# Altium project PHANTOM_VCU.PrjPcb
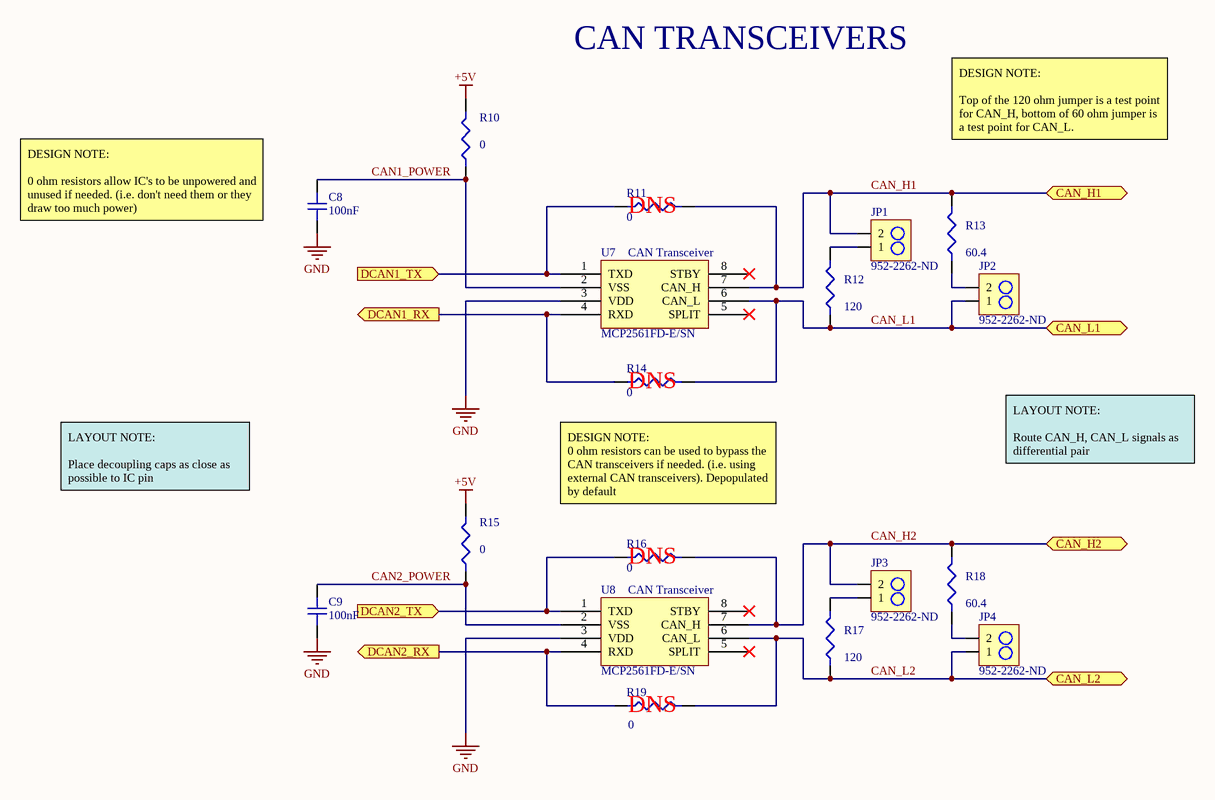
[diagram p0: CAN.SchDoc]
2 sheets, 43 parts. Net scope: flat (ports and power ports of the same name join across sheets).
Board file: VCU_LAYOUT.PcbDoc
Sheets:
  CAN.SchDoc
  Contactor_Switching.SchDoc

## Sheet CAN.SchDoc
size A4; DocumentNumber: 4; SheetNumber: 5; SheetTotal: 7

### Parts
C8  100nF  [C0805]
C9  100nF  [C0805]
JP1  952-2262-ND  [2PIN_HEADER]
JP2  952-2262-ND  [2PIN_HEADER]
JP3  952-2262-ND  [2PIN_HEADER]
JP4  952-2262-ND  [2PIN_HEADER]
R10  0  [R0805]
R11  0  [R0805]
R12  120  [R0805]
R13  60.4  [R0805]
R14  0  [R0805]
R15  0  [R0805]
R16  0  [R0805]
R17  120  [R0805]
R18  60.4  [R0805]
R19  0  [R0805]
U7  MCP2561FD-E/SN  [8-SOIC_MCP2561]
U8  MCP2561FD-E/SN  [8-SOIC_MCP2561]

### Ports
CAN_H1, CAN_H2, CAN_L1, CAN_L2, DCAN1_RX, DCAN1_TX, DCAN2_RX, DCAN2_TX

### Nets
+5V: R10.2 R15.2
GND: C8.1 C9.1 U7.3(VDD) U8.3(VDD)
CAN1_POWER: C8.2 R10.1 U7.2(VSS)
CAN2_POWER: C9.2 R15.1 U8.2(VSS)
CAN_H1: JP1.2 R11.2 R13.2 U7.7(CAN_H) ; port CAN_H1
CAN_H2: JP3.2 R16.2 R18.2 U8.7(CAN_H) ; port CAN_H2
CAN_L1: JP2.1 R12.1 R14.2 U7.6(CAN_L) ; port CAN_L1
CAN_L2: JP4.1 R17.1 R19.2 U8.6(CAN_L) ; port CAN_L2
NetJP1_1: JP1.1 R12.2
NetJP2_2: JP2.2 R13.1
NetJP3_1: JP3.1 R17.2
NetJP4_2: JP4.2 R18.1
NetR11_1: R11.1 U7.1(TXD) ; port DCAN1_TX
NetR14_1: R14.1 U7.4(RXD) ; port DCAN1_RX
NetR16_1: R16.1 U8.1(TXD) ; port DCAN2_TX
NetR19_1: R19.1 U8.4(RXD) ; port DCAN2_RX

Not connected (* = marked no-connect by the designer): U7 5(SPLIT)* 8(STBY)*; U8 5(SPLIT)* 8(STBY)*

### Notes on the sheet
- CAN TRANSCEIVERS
- DESIGN NOTE:
  Top of the 120 ohm jumper is a test point for CAN_H, bottom of 60 ohm jumper is a test point for CAN_L.
- DESIGN NOTE:
  0 ohm resistors allow IC's to be unpowered and unused if needed. (i.e. don't need them or they draw too much power)
- (near R11) DNS
- (near U7) CAN Transceiver
- (near R14) DNS
- LAYOUT NOTE:
  Place decoupling caps as close as possible to IC pin
- LAYOUT NOTE:
  Route CAN_H, CAN_L signals as differential pair
- DESIGN NOTE:
  0 ohm resistors can be used to bypass the CAN transceivers if needed. (i.e. using external CAN transceivers). Depopulated by default
- (near U8) CAN Transceiver
- (near R16) DNS
- (near R19) DNS

### Library data of the parts
C8 C9 = GRM21B7U1A104JA01L: MLCC SMD CAP 100nF 10Volts U2J 5%; Manufacturer: Murata; Voltage Rating: 10V; Supplier 1: Digi-Key; Manufacturer Part Number: GRM21B7U1A104JA01L; Stock 1: 6000; Pricing 1: 1=0.46, 10=0.32, 100=0.192, 500=0.144, 1000=0.1216 (USD); Mount: Surface Mount; Case/Package: 0805; Case Code (Imperial): 0805; Case Code (Metric): 2012; Min Operating Temperature: -55°C; Max Operating Temperature: 125°C; Capacitance: 100nF; Voltage Rating (DC): 10V; Tolerance: 5%; Packaging: Tape and Reel; Package Quantity: 3000; Dielectric: U2J; Termination: SMD/SMT; Length: 2mm; Height: 1.25mm; Width: 0.049inch; Thickness: 0.053inch; Depth: 1.25mm; Radiation Hardening: No; ComponentLink1URL: https://datasheet.ciiva.com/5424/product-5424660.pdf; ComponentLink1Description: https://datasheet.ciiva.com/5424/product-5424660.pdf; ComponentLink2URL: https://datasheet.ciiva.com/17451/product-17451845.pdf; ComponentLink2Description: https://datasheet.ciiva.com/17451/product-17451845.pdf; ComponentLink3URL: https://datasheet.ciiva.com/11618/product-11618924.pdf; ComponentLink3Description: https://datasheet.ciiva.com/11618/product-11618924.pdf; Supplier Part Number 1: 490-11592-6-ND
JP1-JP4 = M20-9990246: Headers & Wire Housings 02 SIL VERTICAL PIN HEADER TIN; Manufacturer: Harwin; Contact Resistance: 30mR; Max Current Rating: 3A; Number of Positions: 2; Gender: Male; Connector Type: Male Pin; Insulation Resistance: 10GR; Voltage Rating (AC): 750V; Pitch: 2.54mm; Supplier 1: Digi-Key; Manufacturer Part Number: M20-9990246; Stock 1: 53577; Pricing 1: 1=0.11, 10=0.099, 100=0.0609, 500=0.0504, 1000=0.0441, 5000=0.0378, 10000=0.0368 (USD); Case/Package: SIL; Colour: Black; Housing Colour: Black; Housing Material: Nylon; Contact Plating: Tin; Contact Material: Bronze,Brass; Min Operating Temperature: -40°C; Max Operating Temperature: 105°C; Package Quantity: 1000; Packaging: Bulk; Termination: Solder; Number of Rows: 1; Number of Contacts: 2; Orientation: Straight; Current Rating: 3A; Length: 5.08mm; Depth: 2.54mm; Contact Mating Length: 0.24inch; Radiation Hardening: No; REACH SVHC: No SVHC; ComponentLink1URL: https://datasheet.ciiva.com/8046/315376-8046930.pdf; ComponentLink1Description: https://datasheet.ciiva.com/8046/315376-8046930.pdf; ComponentLink2URL: https://datasheet.ciiva.com/6833/m20-999-6833368.pdf; ComponentLink2Description: https://datasheet.ciiva.com/6833/m20-999-6833368.pdf; ComponentLink3URL: https://datasheet.ciiva.com/11745/0900766b81034e61-11745755.pdf; ComponentLink3Description: https://datasheet.ciiva.com/11745/0900766b81034e61-11745755.pdf; ComponentLink4URL: https://datasheet.ciiva.com/22660/1830818-22660571.pdf; ComponentLink4Description: https://datasheet.ciiva.com/22660/1830818-22660571.pdf; ComponentLink5URL: https://datasheet.ciiva.com/26852/getdatasheetpartid-384170-26852203.pdf; ComponentLink5Description: https://datasheet.ciiva.com/26852/getdatasheetpartid-384170-26852203.pdf; Supplier Part Number 1: 952-2262-ND
R10 R11 R14-R16 R19 = RC0805JR-070RL: RES SMD 0 OHM 1/8W 0805; Manufacturer: Yageo; Resistance: 0mR; Tolerance: 5%; Voltage Rating: 150V; Power Rating: 125mW; Temperature Coefficient: 200ppm/°C; Supplier 1: Digi-Key; Manufacturer Part Number: RC0805JR-070RL; Stock 1: 5922085; Pricing 1: 1=0.1, 10=0.018, 25=0.0128, 50=0.0096, 100=0.0071, 250=0.0054, 500=0.0044, 1000=0.0032 (USD); Case/Package: 0805; Number of Pins: 2; Case Code (Imperial): 0805; Case Code (Metric): 2012; Contact Plating: Tin,Matte; Min Operating Temperature: -55°C; Max Operating Temperature: 155°C; Packaging: Tape and Reel; Voltage Rating (DC): 150V; Termination: SMD/SMT; Composition: Thick Film; Military Standard: Not; Length: 2mm; Height: 0.5mm; Width: 1.25mm; Depth: 1.25mm; Radiation Hardening: No; REACH SVHC: Unknown; Lead Free: Lead Free; ComponentLink1URL: https://datasheet.ciiva.com/7941/1738694-7941861.pdf; ComponentLink1Description: https://datasheet.ciiva.com/7941/1738694-7941861.pdf; ComponentLink2URL: https://datasheet.ciiva.com/7941/1738694-7941862.pdf; ComponentLink2Description: https://datasheet.ciiva.com/7941/1738694-7941862.pdf; ComponentLink3URL: https://datasheet.ciiva.com/11819/0900766b8106beab-11819430.pdf; ComponentLink3Description: https://datasheet.ciiva.com/11819/0900766b8106beab-11819430.pdf; ComponentLink4URL: https://datasheet.ciiva.com/7941/1738694-7941863.pdf; ComponentLink4Description: https://datasheet.ciiva.com/7941/1738694-7941863.pdf; ComponentLink5URL: https://datasheet.ciiva.com/15190/getdatasheetpartid-330685-15190028.pdf; ComponentLink5Description: https://datasheet.ciiva.com/15190/getdatasheetpartid-330685-15190028.pdf; Supplier Part Number 1: 311-0.0ARDKR-ND
R12 R17 = RC0805FR-07120RL: RES SMD 120 OHM 1% 1/8W 0805; Manufacturer: Yageo; Resistance: 120R; Power Rating: 125mW; Voltage Rating: 150V; Temperature Coefficient: 100ppm/°C; Supplier 1: Digi-Key; Manufacturer Part Number: RC0805FR-07120RL; Stock 1: 632664; Pricing 1: 1=0.1, 10=0.022, 100=0.0088, 1000=0.004, 2500=0.0034 (USD); Case/Package: 0805; Case Code (Metric): 2012; Case Code (Imperial): 0805; Min Operating Temperature: -55°C; Max Operating Temperature: 155°C; Tolerance: 1%; Package Quantity: 1; Packaging: Tape and Reel; Composition: Thick Film; Number of Terminations: 2; Termination: SMD/SMT; Military Standard: Not; Max Power Dissipation: 125mW; Length: 2mm; Height: 0.5mm; Width: 0.049inch; Depth: 1.25mm; REACH SVHC: Unknown; Lead Free: Lead Free; ComponentLink1URL: https://datasheet.ciiva.com/2491/pyu-r-int-thick-7-2491585.pdf; ComponentLink1Description: https://datasheet.ciiva.com/2491/pyu-r-int-thick-7-2491585.pdf; ComponentLink2URL: https://datasheet.ciiva.com/2491/pyu-r-int-thick-7-2491586.pdf; ComponentLink2Description: https://datasheet.ciiva.com/2491/pyu-r-int-thick-7-2491586.pdf; ComponentLink3URL: https://datasheet.ciiva.com/2491/pyu-r-int-thick-7-2491587.pdf; ComponentLink3Description: https://datasheet.ciiva.com/2491/pyu-r-int-thick-7-2491587.pdf; ComponentLink4URL: https://datasheet.ciiva.com/12558/rc0805-257173-12558661.pdf; ComponentLink4Description: https://datasheet.ciiva.com/12558/rc0805-257173-12558661.pdf; ComponentLink5URL: https://datasheet.ciiva.com/11819/0900766b8106beab-11819786.pdf; ComponentLink5Description: https://datasheet.ciiva.com/11819/0900766b8106beab-11819786.pdf; ComponentLink6URL: https://datasheet.ciiva.com/7941/444164-7941691.pdf; ComponentLink6Description: https://datasheet.ciiva.com/7941/444164-7941691.pdf; ComponentLink7URL: https://datasheet.ciiva.com/7941/444164-7941692.pdf; ComponentLink7Description: https://datasheet.ciiva.com/7941/444164-7941692.pdf; ComponentLink8URL: https://datasheet.ciiva.com/16964/rc0805-16964606.pdf; ComponentLink8Description: https://datasheet.ciiva.com/16964/rc0805-16964606.pdf; Supplier Part Number 1: 311-120CRCT-ND
R13 R18 = RC0805FR-0760R4L: RES SMD 60.4 OHM 1% 1/8W 0805; Manufacturer: Yageo; Resistance: 60.4R; Power Rating: 125mW; Temperature Coefficient: 100ppm/°C; Voltage Rating (DC): 150V; Supplier 1: Digi-Key; Manufacturer Part Number: RC0805FR-0760R4L; Stock 1: 189238; Pricing 1: 1=0.1, 10=0.022, 100=0.0088, 1000=0.004, 2500=0.0034 (USD); Case/Package: 0805; Case Code (Metric): 2012; Case Code (Imperial): 0805; Contact Plating: Tin,Lead,Matte; Min Operating Temperature: -55°C; Max Operating Temperature: 155°C; Package Quantity: 1; Tolerance: 1%; Packaging: Tape and Reel; Composition: Thick Film; Military Standard: Not; Voltage Rating: 150V; Number of Terminations: 2; Termination: SMD/SMT; Max Power Dissipation: 125mW; Length: 0.079inch; Height: 0.024inch; Width: 0.049inch; Depth: 1.25mm; Radiation Hardening: No; Lead Free: Lead Free; ComponentLink1URL: https://datasheet.ciiva.com/2457/pyu-r-int-thick-7-2457216.pdf; ComponentLink1Description: https://datasheet.ciiva.com/2457/pyu-r-int-thick-7-2457216.pdf; ComponentLink2URL: https://datasheet.ciiva.com/2457/pyu-r-int-thick-7-2457217.pdf; ComponentLink2Description: https://datasheet.ciiva.com/2457/pyu-r-int-thick-7-2457217.pdf; ComponentLink3URL: https://datasheet.ciiva.com/2457/pyu-r-int-thick-7-2457215.pdf; ComponentLink3Description: https://datasheet.ciiva.com/2457/pyu-r-int-thick-7-2457215.pdf; Supplier Part Number 1: 311-60.4CRDKR-ND
U7 U8 = MCP2561FD-E/SN: MICROCHIP         MCP2561FD-E/SN            CAN Bus, Transceiver, CAN, 1, 1, 4.5 V, 5.5 V, SOIC; Number of Receivers: 1; Data Rate: 8Mbps; Min Supply Voltage: 4.5V; Max Supply Voltage: 5.5V; Max Supply Current: 70mA; Receiver Hysteresis: 200mV; Supplier 1: Digi-Key; Manufacturer: Microchip; Manufacturer Part Number: MCP2561FD-E/SN; Stock 1: 1072; Pricing 1: 1=0.97, 25=0.8084, 100=0.735 (USD); Case/Package: SOIC; Number of Pins: 8; Weight: 0.019048oz; Min Operating Temperature: -40°C; Max Operating Temperature: 125°C; Packaging: Rail/Tube; Number of Transceivers: 1; Logic Function: Transceiver; Interface: CAN; Number of Drivers: 1; Number of Transmit Buffers: 1; Number of Receive Buffers: 1; Operating Supply Current: 70mA; Package Quantity: 100; Length: 4.9mm; Height: 1.5mm; Width: 3.9mm; REACH SVHC: No SVHC; Lead Free: Lead Free; ComponentLink1URL: https://datasheet.ciiva.com/48512/mcp2561fd-eng-tds-48512069.pdf; ComponentLink1Description: https://datasheet.ciiva.com/48512/mcp2561fd-eng-tds-48512069.pdf; ComponentLink2URL: https://datasheet.ciiva.com/46406/1821190-46406024.pdf; ComponentLink2Description: https://datasheet.ciiva.com/46406/1821190-46406024.pdf; ComponentLink3URL: https://datasheet.ciiva.com/46406/1821190-46406056.pdf; ComponentLink3Description: https://datasheet.ciiva.com/46406/1821190-46406056.pdf; ComponentLink4URL: https://datasheet.ciiva.com/48473/20005284a-48473177.pdf; ComponentLink4Description: https://datasheet.ciiva.com/48473/20005284a-48473177.pdf

## Sheet Contactor_Switching.SchDoc
size A4; DocumentNumber: 5; SheetNumber: 6; SheetTotal: 7
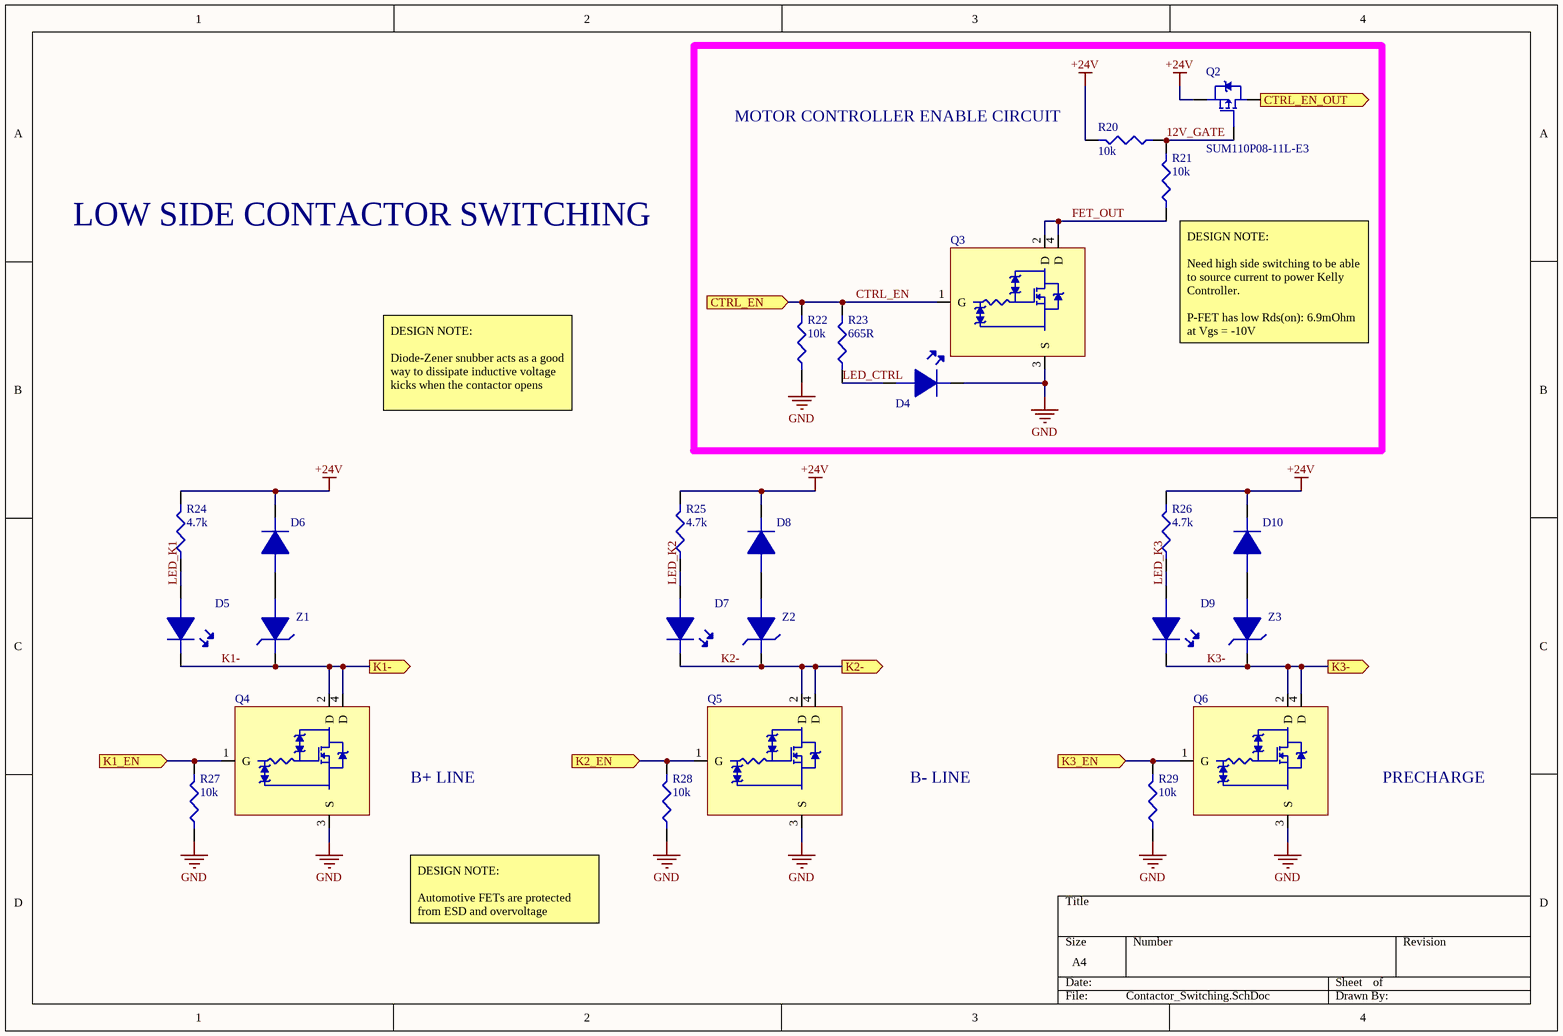
[diagram p1: Contactor_Switching.SchDoc]

### Parts
D4  LTST-C191TBKT-5A  [LED_0603]  (value not drawn)
D5  LTST-C191TBKT-5A  [LED_0603]  (value not drawn)
D6  S3BB-TP  [DO-214AA_Diode]  (value not drawn)
D7  LTST-C191TBKT-5A  [LED_0603]  (value not drawn)
D8  S3BB-TP  [DO-214AA_Diode]  (value not drawn)
D9  LTST-C191TBKT-5A  [LED_0603]  (value not drawn)
D10  S3BB-TP  [DO-214AA_Diode]  (value not drawn)
Q2  SUM110P08-11L-E3  [D2PAK_FETs]
Q3  NCV8406ASTT1G  [SOT-223_NFET]  (value not drawn)
Q4  NCV8406ASTT1G  [SOT-223_NFET]  (value not drawn)
Q5  NCV8406ASTT1G  [SOT-223_NFET]  (value not drawn)
Q6  NCV8406ASTT1G  [SOT-223_NFET]  (value not drawn)
R20  10k  [R0805]
R21  10k  [R0805]
R22  10k  [R0805]
R23  665R  [R0805]
R24  4.7k  [R0805]
R25  4.7k  [R0805]
R26  4.7k  [R0805]
R27  10k  [R0805]
R28  10k  [R0805]
R29  10k  [R0805]
Z1  12V  [DO-214AA_Diode]  (value not drawn)
Z2  12V  [DO-214AA_Diode]  (value not drawn)
Z3  12V  [DO-214AA_Diode]  (value not drawn)

### Blocks framed on the sheet
MOTOR CONTROLLER ENABLE CIRCUIT: D4 Q2 Q3 R20-R23

### Ports
CTRL_EN, CTRL_EN_OUT, K1-, K1_EN, K2-, K2_EN, K3-, K3_EN

### Nets
+24V: D6.2 D8.2 D10.2 Q2.4 R20.2 R24.2 R25.2 R26.2
GND: D4.2 Q3.3(S) Q4.3(S) Q5.3(S) Q6.3(S) R22.1 R27.1 R28.1 R29.1
12V_GATE: Q2.1 R20.1 R21.2
CTRL_EN: Q3.1(G) R22.2 R23.2 ; port CTRL_EN
FET_OUT: Q3.2(D) Q3.4(D) R21.1
K1-: D5.2 Q4.2(D) Q4.4(D) Z1.2 ; port K1-
K2-: D7.2 Q5.2(D) Q5.4(D) Z2.2 ; port K2-
K3-: D9.2 Q6.2(D) Q6.4(D) Z3.2 ; port K3-
LED_CTRL: D4.1 R23.1
LED_K1: D5.1 R24.1
LED_K2: D7.1 R25.1
LED_K3: D9.1 R26.1
NetD6_1: D6.1 Z1.1
NetD8_1: D8.1 Z2.1
NetD10_1: D10.1 Z3.1
NetQ2_3: Q2.3 ; port CTRL_EN_OUT
NetQ4_1: Q4.1(G) R27.2 ; port K1_EN
NetQ5_1: Q5.1(G) R28.2 ; port K2_EN
NetQ6_1: Q6.1(G) R29.2 ; port K3_EN

### Notes on the sheet
- LOW SIDE CONTACTOR SWITCHING
- (near R21) DESIGN NOTE:
  Need high side switching to be able to source current to power Kelly Controller.
  P-FET has low Rds(on): 6.9mOhm at Vgs = -10V
- DESIGN NOTE:
  Diode-Zener snubber acts as a good way to dissipate inductive voltage kicks when the contactor opens
- B+ LINE
- B- LINE
- PRECHARGE
- DESIGN NOTE:
  Automotive FETs are protected from ESD and overvoltage

### Library data of the parts
D4 D5 D7 D9 = LTST-C191TBKT-5A: LED BLUE CLEAR 0603 SMD; Manufacturer: Vishay Lite-On; Lens Colour: Colorless; Lens Style: Diffused,Colorless,Rectangular; Viewing Angle: 130°; Forward Current: 20mA; Forward Voltage: 2.8V; Luminous Intensity: 15mcd; Test Current: 5mA; Dominant Wavelength: 473nm; Number of LEDs: 1; Voltage: 29V; Supplier 1: Digi-Key; Manufacturer Part Number: LTST-C191TBKT-5A; Stock 1: 2918; Pricing 1: 1=0.52, 10=0.376, 25=0.2884, 100=0.1881, 250=0.138, 500=0.117, 1000=0.0961, 2500=0.0836 (USD); Mount: Surface Mount; Case/Package: 0603; Colour: Blue; Case Code (Metric): 1608; Case Code (Imperial): 0603; Min Operating Temperature: -20°C; Max Operating Temperature: 80°C; Packaging: Tape and Reel; Package Quantity: 5000; Illumination Colour: Blue; Lens Transparency: Clear; Length: 1.6mm; Height: 0.55mm; Width: 0.8mm; Radiation Hardening: No; ComponentLink1URL: http://components.arrow.com/part/dataview/52218576S9813001N1331; ComponentLink1Description: http://components.arrow.com/part/dataview/52218576S9813001N1331; ComponentLink2URL: http://optoelectronics.liteon.com/zh-cn/api/DwonloadFileHandler.ashx?txtSpecNo=DS22-2003-020&txtPartNo=LTST-C191TBKT-5A; ComponentLink2Description: http://optoelectronics.liteon.com/zh-cn/api/DwonloadFileHandler.ashx?txtSpecNo=DS22-2003-020&txtPartNo=LTST-C191TBKT-5A; Supplier Part Number 1: 160-2212-6-ND
D6 D8 D10 = S3BB-TP: DIODE GEN PURP 100V 3A DO214AA; Manufacturer: MCC; Max Surge Current: 100A; Forward Voltage: 1.15V; Peak Reverse Current: 10uA; Element Configuration: Single; Supplier 1: Digi-Key; Manufacturer Part Number: S3BB-TP; Stock 1: 10943; Pricing 1: 1=0.56, 10=0.441, 25=0.372, 100=0.3028, 250=0.2509, 500=0.2076, 1000=0.1557 (USD); Mount: Surface Mount; Number of Pins: 2; Packaging: Tape and Reel; Package Quantity: 1; Reverse Voltage (DC): 100V; Average Rectified Current: 3A; Peak Non-Repetitive Surge Current: 100A; Max Repetitive Reverse Voltage (Vrrm): 100V; Radiation Hardening: No; Lead Free: Lead Free; ComponentLink1URL: https://datasheet.ciiva.com/914/s3ab-s3mbsmb-914278.pdf; ComponentLink1Description: https://datasheet.ciiva.com/914/s3ab-s3mbsmb-914278.pdf; ComponentLink2URL: https://datasheet.ciiva.com/914/s3ab-s3mbsmb-914279.pdf; ComponentLink2Description: https://datasheet.ciiva.com/914/s3ab-s3mbsmb-914279.pdf; ComponentLink3URL: https://datasheet.ciiva.com/914/s3ab-s3mbsmb-914280.pdf; ComponentLink3Description: https://datasheet.ciiva.com/914/s3ab-s3mbsmb-914280.pdf; ComponentLink4URL: https://datasheet.ciiva.com/15200/getdatasheetpartid-686538-15200554.pdf; ComponentLink4Description: https://datasheet.ciiva.com/15200/getdatasheetpartid-686538-15200554.pdf; ComponentLink5URL: https://datasheet.ciiva.com/17437/s3ab-s3mbsmb-17437836.pdf; ComponentLink5Description: https://datasheet.ciiva.com/17437/s3ab-s3mbsmb-17437836.pdf; Supplier Part Number 1: S3BB-TPMSCT-ND
Q2 = SUM110P08-11L-E3: Trans MOSFET P-CH 80V 23.5A 3-Pin(2+Tab) TO-263; Manufacturer: Vishay; Drain to Source Voltage (Vdss): -80V; Threshold Voltage: -3V; Max Power Dissipation: 375W; Number of Elements: 1; Power Dissipation: 13.6W; Gate to Source Voltage (Vgs): 20V; Fall Time: 550ns; Turn-On Delay Time: 20ns; Rise Time: 330ns; Turn-Off Delay Time: 135ns; Drain to Source Resistance: 11.1mR; Supplier 1: Digi-Key; Manufacturer Part Number: SUM110P08-11L-E3; Stock 1: 11394; Pricing 1: 1=5.01, 10=4.503, 25=4.2572, 100=3.6896, 250=3.5004 (USD); Mount: Surface Mount; Case/Package: TO-263; Number of Pins: 3; Contact Plating: Tin,Matte; Min Operating Temperature: -50°C; Max Operating Temperature: 175°C; Continuous Drain Current (ID): 23.5A; Packaging: Tape and Reel; REACH SVHC: No SVHC; Lead Free: Lead Free; ComponentLink1URL: https://datasheet.ciiva.com/25652/sum110p0-25652054.pdf; ComponentLink1Description: https://datasheet.ciiva.com/25652/sum110p0-25652054.pdf; Supplier Part Number 1: SUM110P08-11L-E3CT-ND
Q3-Q6 = NCV8406ASTT1G: Self-Protected Low Side Driver Automotive 4-Pin(3+Tab) SOT-223 T/R; Manufacturer: ON Semiconductor; Number of Outputs: 1; Max Output Current: 7A; Interface: On/Off; On-State Resistance: 210mR; Fault Protection: Over Voltage,Over Temperature; Supplier 1: Digi-Key; Manufacturer Part Number: NCV8406ASTT1G; Stock 1: 277; Pricing 1: 1=1.41, 10=1.258, 100=0.981, 500=0.8104 (USD); Mount: Surface Mount; Case/Package: TO-261-4; Number of Pins: 4; Min Operating Temperature: -40°C; Max Operating Temperature: 150°C; Packaging: Tape and Reel; Package Quantity: 1000; Length: 6.5mm; Height: 1.57mm; Radiation Hardening: No; Lead Free: Lead Free; Halogen Free: Halogen Free; ComponentLink1URL: https://datasheet.ciiva.com/15265/htmls5-15265281.pdf; ComponentLink1Description: https://datasheet.ciiva.com/15265/htmls5-15265281.pdf; ComponentLink2URL: https://datasheet.ciiva.com/1956/ncv8406-d-1956280.pdf; ComponentLink2Description: https://datasheet.ciiva.com/1956/ncv8406-d-1956280.pdf; ComponentLink3URL: https://datasheet.ciiva.com/16217/ncv8406-d-16217275.pdf; ComponentLink3Description: https://datasheet.ciiva.com/16217/ncv8406-d-16217275.pdf; Supplier Part Number 1: NCV8406ASTT1GOSDKR-ND
R20-R22 R27-R29 = RC0805FR-071KL: RES SMD 10K OHM 1% 1/8W 0805; Manufacturer: Yageo Phycomp; Temperature Coefficient: 100ppm/°C; Resistance: 1KR; Voltage Rating (DC): 150V; Power Rating: 125mW; Supplier 1: Digi-Key; Manufacturer Part Number: RC0805FR-071KL; Stock 1: 5527973; Pricing 1: 1=0.1, 10=0.022, 100=0.0088, 1000=0.004, 2500=0.0034 (USD); Case/Package: 0805; Number of Pins: 2; Min Operating Temperature: -55°C; Max Operating Temperature: 155°C; Tolerance: 1%; Packaging: Cut Tape; Length: 2mm; Height: 0.5mm; Width: 1.25mm; Depth: 1.25mm; REACH SVHC: No SVHC; Lead Free: Lead Free
R23 = RC0805FR-07665RL: RES SMD 665 OHM 1% 1/8W 0805; Manufacturer: Yageo; Power Rating: 125mW; Temperature Coefficient: 100ppm/°C; Voltage Rating (DC): 150V; Supplier 1: Digi-Key; Manufacturer Part Number: RC0805FR-07665RL; Stock 1: 51898; Pricing 1: 1=0.1, 10=0.022, 100=0.0088, 1000=0.004, 2500=0.0034 (USD); Case/Package: 0805; Case Code (Imperial): 0805; Case Code (Metric): 2012; Min Operating Temperature: -55°C; Max Operating Temperature: 155°C; Resistance: 665R; Tolerance: 1%; Packaging: Tape and Reel; Composition: Thick Film; Package Quantity: 1; Voltage Rating: 150V; Termination: SMD/SMT; Number of Terminations: 2; Military Standard: Not; Max Power Dissipation: 125mW; Length: 2mm; Height: 0.024inch; Width: 1.25mm; Depth: 1.25mm; Lead Free: Lead Free; ComponentLink1URL: https://datasheet.ciiva.com/17423/rc0805-17423095.pdf; ComponentLink1Description: https://datasheet.ciiva.com/17423/rc0805-17423095.pdf; ComponentLink2URL: https://datasheet.ciiva.com/12561/rc0805-257173-12561528.pdf; ComponentLink2Description: https://datasheet.ciiva.com/12561/rc0805-257173-12561528.pdf; ComponentLink3URL: https://datasheet.ciiva.com/2457/pyu-r-int-thick-7-2457788.pdf; ComponentLink3Description: https://datasheet.ciiva.com/2457/pyu-r-int-thick-7-2457788.pdf; ComponentLink4URL: https://datasheet.ciiva.com/2457/pyu-r-int-thick-7-2457789.pdf; ComponentLink4Description: https://datasheet.ciiva.com/2457/pyu-r-int-thick-7-2457789.pdf; ComponentLink5URL: https://datasheet.ciiva.com/2457/pyu-r-int-thick-7-2457790.pdf; ComponentLink5Description: https://datasheet.ciiva.com/2457/pyu-r-int-thick-7-2457790.pdf; Supplier Part Number 1: 311-665CRDKR-ND
R24-R26 = RC0805FR-074K7L: RES SMD 4.7K OHM 1% 1/8W 0805; Manufacturer: Yageo; Resistance: 4.7KR; Temperature Coefficient: 100ppm/°C; Power Rating: 125mW; Voltage Rating: 150V; Supplier 1: Digi-Key; Manufacturer Part Number: RC0805FR-074K7L; Stock 1: 2632902; Pricing 1: 1=0.1, 10=0.022, 100=0.0088, 1000=0.004, 2500=0.0034 (USD); Case/Package: 0805; Number of Pins: 2; Case Code (Metric): 2012; Case Code (Imperial): 0805; Min Operating Temperature: -55°C; Max Operating Temperature: 155°C; Packaging: Tape and Reel; Tolerance: 1%; Composition: Thick Film; Voltage Rating (DC): 150V; Termination: SMD/SMT; Military Standard: Not; Package Quantity: 5000; Number of Terminations: 2; Max Power Dissipation: 125mW; Length: 0.079inch; Height: 0.024inch; Width: 0.049inch; Depth: 1.25mm; REACH SVHC: No SVHC; Lead Free: Lead Free; ComponentLink1URL: https://datasheet.ciiva.com/11808/0900766b8106beab-11808155.pdf; ComponentLink1Description: https://datasheet.ciiva.com/11808/0900766b8106beab-11808155.pdf; ComponentLink2URL: https://datasheet.ciiva.com/7941/444164-7941804.pdf; ComponentLink2Description: https://datasheet.ciiva.com/7941/444164-7941804.pdf; ComponentLink3URL: https://datasheet.ciiva.com/7941/1686128-7941805.pdf; ComponentLink3Description: https://datasheet.ciiva.com/7941/1686128-7941805.pdf; ComponentLink4URL: https://datasheet.ciiva.com/7941/444164-7941806.pdf; ComponentLink4Description: https://datasheet.ciiva.com/7941/444164-7941806.pdf; ComponentLink5URL: https://datasheet.ciiva.com/6547/pyu-r-int-thick-7-6547263.pdf; ComponentLink5Description: https://datasheet.ciiva.com/6547/pyu-r-int-thick-7-6547263.pdf; ComponentLink6URL: https://datasheet.ciiva.com/46447/444164-46447583.pdf; ComponentLink6Description: https://datasheet.ciiva.com/46447/444164-46447583.pdf; Supplier Part Number 1: 311-4.70KCRDKR-ND
Z1-Z3 = SMBJ5349B-TP: DIODE ZENER 12V 5W DO214AA; Manufacturer: MCC; Tolerance: 5%; Forward Voltage: 1.2V; Max Reverse Leakage Current: 2uA; Impedance: 2.5R; Zener Current: 395mA; Test Current: 100mA; Element Configuration: Single; Supplier 1: Digi-Key; Manufacturer Part Number: SMBJ5349B-TP; Stock 1: 41768; Pricing 1: 1=0.65, 10=0.57, 25=0.5044, 100=0.4394, 250=0.3824, 500=0.3255, 1000=0.2604 (USD); Mount: Surface Mount; Case/Package: SMB; Number of Pins: 2; Min Operating Temperature: -55°C; Max Operating Temperature: 150°C; Package Quantity: 3000; Packaging: Tape and Reel; Power Dissipation: 5W; Zener Voltage: 12V; Voltage Tolerance: 5%; Max Power Dissipation: 5W; Working Voltage: 12V; Peak Reverse Current: 2uA; Radiation Hardening: No; Lead Free: Lead Free; ComponentLink1URL: https://datasheet.ciiva.com/894/smbj5338b-smbj5388bsmb-894182.pdf; ComponentLink1Description: https://datasheet.ciiva.com/894/smbj5338b-smbj5388bsmb-894182.pdf; ComponentLink2URL: https://datasheet.ciiva.com/894/smbj5338b-smbj5388bsmb-894183.pdf; ComponentLink2Description: https://datasheet.ciiva.com/894/smbj5338b-smbj5388bsmb-894183.pdf; ComponentLink3URL: https://datasheet.ciiva.com/894/smbj5338b-smbj5388bsmb-894184.pdf; ComponentLink3Description: https://datasheet.ciiva.com/894/smbj5338b-smbj5388bsmb-894184.pdf; ComponentLink4URL: https://datasheet.ciiva.com/17444/smbj5338b-smbj5388bsmb-17444298.pdf; ComponentLink4Description: https://datasheet.ciiva.com/17444/smbj5338b-smbj5388bsmb-17444298.pdf; ComponentLink5URL: https://datasheet.ciiva.com/26844/getdatasheetpartid-147575-26844923.pdf; ComponentLink5Description: https://datasheet.ciiva.com/26844/getdatasheetpartid-147575-26844923.pdf; Supplier Part Number 1: SMBJ5349B-TPMSDKR-ND

## Nets that join several sheets
GND: CAN (C8.1 C9.1 U7.3 U8.3), Contactor_Switching (9 pins)